# Altium schematic sheet Sheet2.SchDoc
size A4
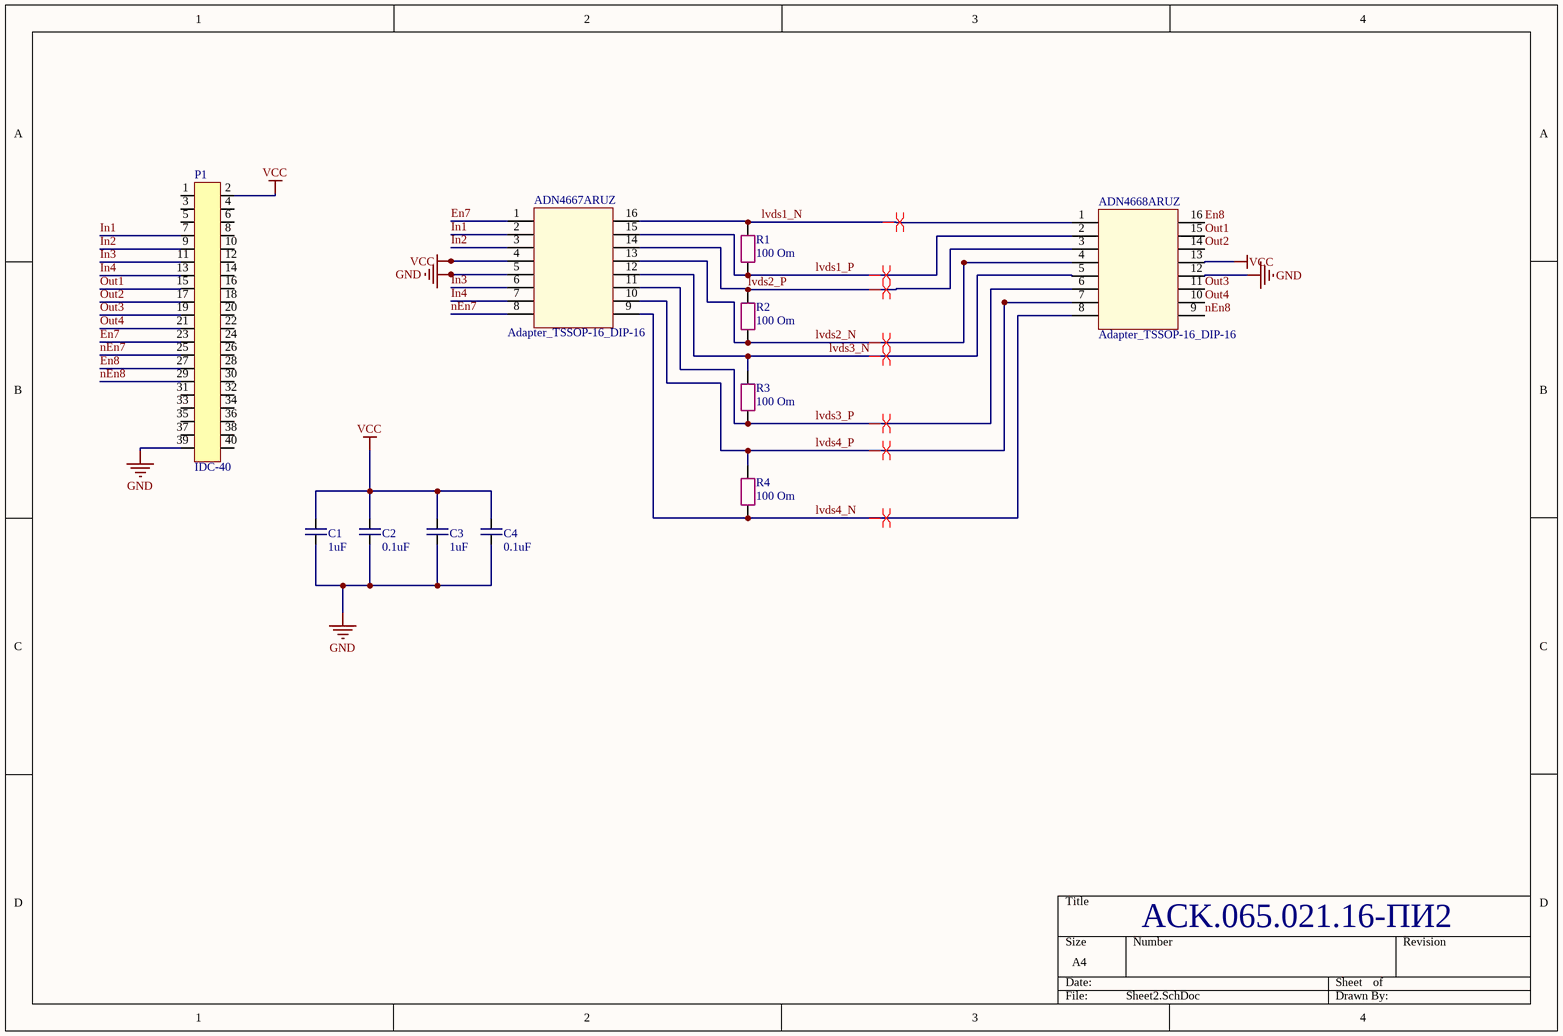
[diagram p0: Sheet2.SchDoc]

## Parts
ADN4667ARUZ  Adapter_TSSOP-16_DIP-16  [Adapter_TSSOP-16_DIP-16]
ADN4668ARUZ  Adapter_TSSOP-16_DIP-16  [Adapter_TSSOP-16_DIP-16]
C1  1uF  [C_0805]
C2  0.1uF  [C_0805]
C3  1uF  [C_0805]
C4  0.1uF  [C_0805]
P1  IDC-40  [IDC-40]
R1  100 Om  [R_0805]
R2  100 Om  [R_0805]
R3  100 Om  [R_0805]
R4  100 Om  [R_0805]

## Nets
GND: ADN4667ARUZ.5 ADN4668ARUZ.12 C1.2 C2.2 C3.2 C4.2 P1.39
VCC: ADN4667ARUZ.4 ADN4668ARUZ.13 C1.1 C2.1 C3.1 C4.1 P1.2
En7: ADN4667ARUZ.1 P1.23
En8: ADN4668ARUZ.16 P1.27
In1: ADN4667ARUZ.2 P1.7
In2: ADN4667ARUZ.3 P1.9
In3: ADN4667ARUZ.6 P1.11
In4: ADN4667ARUZ.7 P1.13
lvds1_N: ADN4667ARUZ.16 ADN4668ARUZ.1 R1.2
lvds1_P: ADN4667ARUZ.15 ADN4668ARUZ.2 R1.1
lvds2_N: ADN4667ARUZ.13 ADN4668ARUZ.4 R2.1
lvds2_P: ADN4667ARUZ.14 ADN4668ARUZ.3 R2.2
lvds3_N: ADN4667ARUZ.12 ADN4668ARUZ.5 R3.2
lvds3_P: ADN4667ARUZ.11 ADN4668ARUZ.6 R3.1
lvds4_N: ADN4667ARUZ.9 ADN4668ARUZ.8 R4.1
lvds4_P: ADN4667ARUZ.10 ADN4668ARUZ.7 R4.2
nEn7: ADN4667ARUZ.8 P1.25
nEn8: ADN4668ARUZ.9 P1.29
Out1: ADN4668ARUZ.15 P1.15
Out2: ADN4668ARUZ.14 P1.17
Out3: ADN4668ARUZ.11 P1.19
Out4: ADN4668ARUZ.10 P1.21

Not connected (* = marked no-connect by the designer): P1 1(0) 3 4 5 6 8 10 12 14 16 18 20 22 24 26 28 30 31 32 33 34 35 36 37 38 40

## Layout directives
differential pair: lvds1_N, lvds1_P, lvds2_N, lvds2_P, lvds3_N, lvds3_P, lvds4_N, lvds4_P

## Notes on the sheet
- ACK.065.021.16-ПИ2

## Library data of the parts
C1-C4 = capacitor 0805
P1 = IDC-40: разъем 2529
R1-R4 = resistor 0805